# EasyEDA Pro project CSR8675 Minimun System.eprj

# Schematic Schematic1
Create Date: 2023-11-17; Page Name: P1; Project Name: CSR8675 Minimun System; Schematic Name: Schematic1; Update Date: 2024-04-19; Company: 嘉立创EDA; Page Size: A4; Version: V1.0
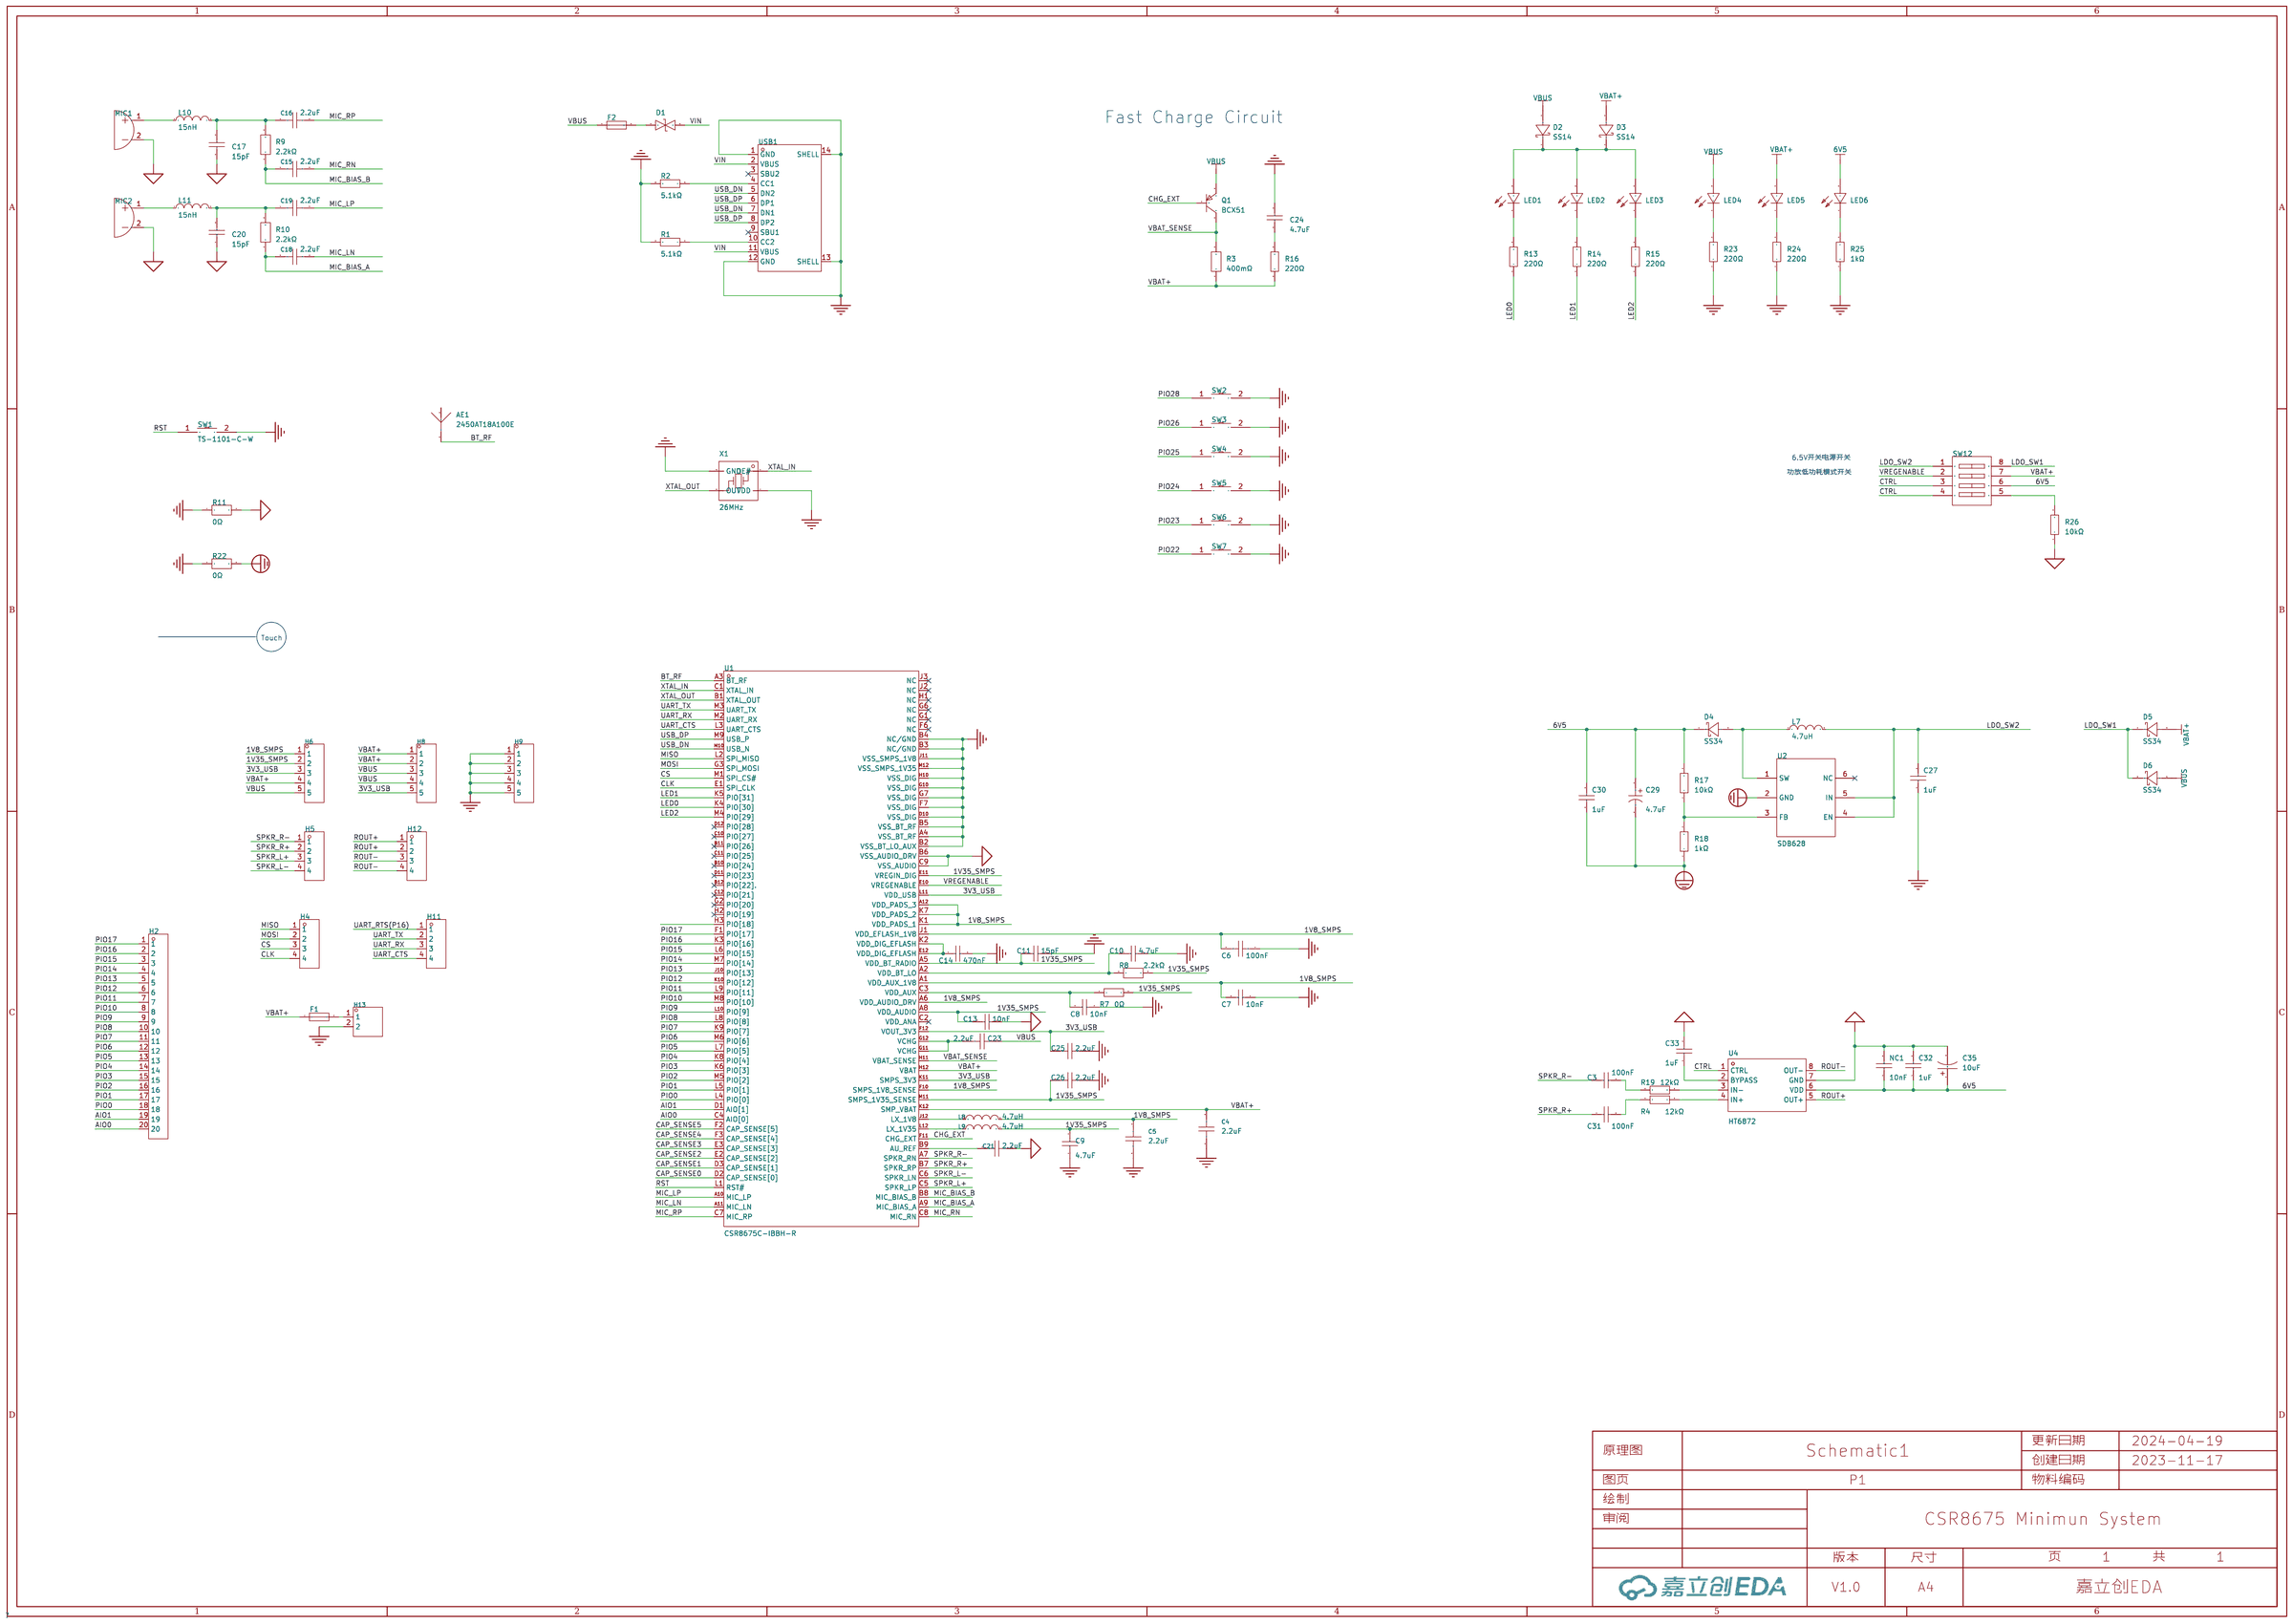
[diagram p0: schematic sheet]

## Parts
AE1  2450AT18A100E  [ANT-SMD_L3.2-W1.6]
C3  100nF  [C0603]
C4  2.2uF  [C0603]
C5  2.2uF  [C0603]
C6  100nF  [C0603]
C7  10nF  [C0603]
C8  10nF  [C0603]
C9  4.7uF  [C0603]
C10  4.7uF  [C0603]
C11  15pF  [C0603]
C13  10nF  [C0603]
C14  470nF  [C0603]
C15  2.2uF  [C0603]
C16  2.2uF  [C0603]
C17  15pF  [C0603]
C18  2.2uF  [C0603]
C19  2.2uF  [C0603]
C20  15pF  [C0603]
C21  2.2uF  [C0603]
C23  2.2uF  [C0603]
C24  4.7uF  [C0805]
C25  2.2uF  [C0603]
C26  2.2uF  [C0603]
C27  1uF  [C0805]
C29  4.7uF  [CAP-TH_BD5.0-P2.00-D0.5-FD]
C30  1uF  [C0805]
C31  100nF  [C0603]
C32  1uF  [C0603]
C33  1uF  [C0603]
C35  10uF  [CAP-TH_BD5.0-P2.00-D0.8-FD]
D1  0603ESDA-05N  [D0603-BI]
D2  SS14  [SOD-123FL_L2.8-W1.8-LS3.7-RD]
D3  SS14  [SOD-123FL_L2.8-W1.8-LS3.7-RD]
D4  SS34  [SMA_L4.3-W2.5-LS5.0-RD]
D5  SS34  [SMA_L4.3-W2.5-LS5.0-RD]
D6  SS34  [SMA_L4.3-W2.5-LS5.0-RD]
F1  BSMD1210L-500  [F1210]
F2  BSMD1210L-500  [F1210]
H2  -  [HDR-TH_20P-P2.54-V-M-1]
H4  -  [HDR-TH_4P-P2.54-V-M]
H5  -  [HDR-TH_4P-P2.54-V-M]
H6  -  [HDR-TH_5P-P2.54-V-M]
H8  -  [HDR-TH_5P-P2.54-V-M]
H9  -  [HDR-TH_5P-P2.54-V-M]
H11  -  [HDR-TH_4P-P2.54-V-M]
H12  -  [HDR-TH_4P-P2.54-V-M]
H13  -  [HDR-TH_2P-P2.54-V-M-1]
L7  4.7uH  [IND-SMD_L4.4-W4.2]
L8  4.7uH  [L0805]
L9  4.7uH  [L0805]
L10  15nH  [L0805]
L11  15nH  [L0805]
LED1  NCD0603R1  [LED0603-RD_RED]
LED2  NCD0603R1  [LED0603-RD_RED]
LED3  NCD0603R1  [LED0603-RD_RED]
LED4  NCD0603R1  [LED0603-RD_RED]
LED5  NCD0603R1  [LED0603-RD_RED]
LED6  NCD0603R1  [LED0603-RD_RED]
MIC1  GMI6027P-34DB  [MIC-TH_BD6.0-P1.90-D0.4-L]
MIC2  GMI6027P-34DB  [MIC-TH_BD6.0-P1.90-D0.4-L]
NC1  10nF  [C0603]
Q1  BCX51  [SOT-89-3_L4.5-W2.5-P1.50-LS4.2-BR]
R1  5.1kΩ  [R0603]
R2  5.1kΩ  [R0603]
R3  400mΩ  [R0805]
R4  12kΩ  [R0603]
R7  0Ω  [R0603]
R8  2.2kΩ  [R0603]
R9  2.2kΩ  [R0603]
R10  2.2kΩ  [R0603]
R11  0Ω  [R0805]
R13  220Ω  [R0603]
R14  220Ω  [R0603]
R15  220Ω  [R0603]
R16  220Ω  [R0805]
R17  10kΩ  [C0805]
R18  1kΩ  [C0805]
R19  12kΩ  [R0603]
R22  0Ω  [R0805]
R23  220Ω  [R0603]
R24  220Ω  [R0603]
R25  1kΩ  [R0603]
R26  10kΩ  [R0603]
SW1  TS-1101-C-W  [SW-SMD_L6.0-W3.3-LS8.0]
SW2  TS-1101-C-W  [SW-SMD_L6.0-W3.3-LS8.0]
SW3  TS-1101-C-W  [SW-SMD_L6.0-W3.3-LS8.0]
SW4  TS-1101-C-W  [SW-SMD_L6.0-W3.3-LS8.0]
SW5  TS-1101-C-W  [SW-SMD_L6.0-W3.3-LS8.0]
SW6  TS-1101-C-W  [SW-SMD_L6.0-W3.3-LS8.0]
SW7  TS-1101-C-W  [SW-SMD_L6.0-W3.3-LS8.0]
SW12  SMXS-04K-TP  [SW-SMD_SMXS-04K-TP]
U1  CSR8675C-IBBH-R  [BGA-112_L6.5-W6.5-P0.50-TL]
U2  SDB628  [SOT-23-6_L2.9-W1.6-P0.95-LS2.8-BR]
U4  HT6872  [SOP-8_L4.9-W3.9-P1.27-LS6.0-BL]
USB1  TYPE-C 16PIN 2MD(073)  [USB-C-SMD_TYPE-C-6PIN-2MD-073]
X1  26MHz  [OSC-SMD_4P-L2.0-W1.6-BL_X201624MKB4SI]

## Library data of the parts
AE1 = 2450AT18A100E: 天线类型:2.4G天线;中心频点:2.4GHz;带宽:-;峰值增益:0.5dBi;极化方式:-;功率容量:2W;驻波比:-;; LCSC Part Name: 2.4G天线; Supplier Part: C89334; Manufacturer: JOHANSON(约翰逊); Supplier Footprint: 1206; JLCPCB Part Class: 扩展库; Datasheet: https://atta.szlcsc.com/upload/public/pdf/source/20180301/C89334_15198946260391384223.pdf; Supplier: LCSC; Antenna Type: 2.4G天线; Central Frequency: 2.4GHz; Peak Gain: 0.5dBi; Impedance: 50Ω; Power capacity: 2W; Operating Temperature: -40℃~+125℃
C3 C31 = 0603B104K500NT: 容值:100nF;精度:±10%;额定电压:50V;材质(温度系数):X7R;; LCSC Part Name: 100nF ±10% 50V; Supplier Part: C30926; Manufacturer: FH(风华); Supplier Footprint: 0603; JLCPCB Part Class: 扩展库; Datasheet: https://atta.szlcsc.com/upload/public/pdf/source/20200305/C486355_26A10D38EF8C2A5C37091D0039909270.pdf; Supplier: LCSC; Tolerance: ±10%; Voltage Rated: 50V; Temperature Coefficient: X7R
C4 C5 C15 C16 C18 C19 C21 = CL10A225KB8NNNC: 容值:2.2uF;精度:±10%;额定电压:50V;材质(温度系数):X5R;; LCSC Part Name: 2.2uF ±10% 50V; Supplier Part: C913904; Manufacturer: SAMSUNG(三星); Supplier Footprint: 0603; JLCPCB Part Class: 扩展库; Datasheet: https://atta.szlcsc.com/upload/public/pdf/source/20160218/1457707763339.pdf; Supplier: LCSC; Tolerance: ±10%; Voltage Rated: 50V; Temperature Coefficient: X5R
C6 = CC0603KRX7R9BB104: 容值:100nF;精度:±10%;额定电压:50V;材质(温度系数):X7R;; LCSC Part Name: 100nF ±10% 50V; Supplier Part: C14663; Manufacturer: YAGEO(国巨); Supplier Footprint: 0603; JLCPCB Part Class: 基础库; Datasheet: https://atta.szlcsc.com/upload/public/pdf/source/20180910/C282072_33301C7F631E79921B82A8DAC6BCC5B3.pdf; Supplier: LCSC; Tolerance: ±10%; Voltage Rated: 50V; Temperature Coefficient: X7R
C7 C8 C13 NC1 = CC0603KRX7R9BB103: 容值:10nF;精度:±10%;额定电压:50V;材质(温度系数):X7R;; LCSC Part Name: 10nF ±10% 50V; Supplier Part: C100042; Manufacturer: YAGEO(国巨); Supplier Footprint: 0603; JLCPCB Part Class: 扩展库; Datasheet: https://atta.szlcsc.com/upload/public/pdf/source/20181008/C309510_22F155564471FAF6A489F7D68F34234E.pdf; Supplier: LCSC; Tolerance: ±10%; Voltage Rated: 50V; Temperature Coefficient: X7R
C9 C24 = CL21A475KAQNNNE: 容值:4.7uF;精度:±10%;额定电压:25V;材质(温度系数):X5R;; LCSC Part Name: 4.7uF ±10% 25V; Supplier Part: C1779; Manufacturer: SAMSUNG(三星); Supplier Footprint: 0805; JLCPCB Part Class: 基础库; Datasheet: https://atta.szlcsc.com/upload/public/pdf/source/20160218/1457707763339.pdf; Supplier: LCSC; Tolerance: ±10%; Voltage Rated: 25V; Temperature Coefficient: X5R
C10 = CL10A475KO8NNNC: 容值:4.7uF;精度:±10%;额定电压:16V;材质(温度系数):X5R;; LCSC Part Name: 4.7uF ±10% 16V; Supplier Part: C19666; Manufacturer: SAMSUNG(三星); Supplier Footprint: 0603; JLCPCB Part Class: 基础库; Datasheet: https://atta.szlcsc.com/upload/public/pdf/source/20160218/1457707763339.pdf; Supplier: LCSC; Tolerance: ±10%; Voltage Rated: 16V; Temperature Coefficient: X5R
C11 C17 C20 = CC0603JRNPO9BN150: 容值:15pF;精度:±5%;额定电压:50V;材质(温度系数):NP0;; LCSC Part Name: 15pF ±5% 50V; Supplier Part: C107037; Manufacturer: YAGEO(国巨); Supplier Footprint: 0603; JLCPCB Part Class: 扩展库; Datasheet: https://atta.szlcsc.com/upload/public/pdf/source/20170914/C128857_1505359892143968080.pdf; Supplier: LCSC; Tolerance: ±5%; Voltage Rated: 50V; Temperature Coefficient: NP0
C14 = CL10B474KA8NNNC: 容值:470nF;精度:±10%;额定电压:25V;材质(温度系数):X7R;; LCSC Part Name: 470nF ±10% 25V; Supplier Part: C1623; Manufacturer: SAMSUNG(三星); Supplier Footprint: 0603; JLCPCB Part Class: 基础库; Datasheet: https://atta.szlcsc.com/upload/public/pdf/source/20160218/1457707763339.pdf; Supplier: LCSC; Tolerance: ±10%; Voltage Rated: 25V; Temperature Coefficient: X7R
C23 C25 C26 = GRM21BD72A225KE01L: 容值:2.2uF;精度:±10%;额定电压:100V;材质(温度系数):X7T;; LCSC Part Name: 2.2uF ±10% 100V; Supplier Part: C2981733; Manufacturer: muRata(村田); Supplier Footprint: 0805; JLCPCB Part Class: 扩展库; Datasheet: https://atta.szlcsc.com/upload/public/pdf/source/20220321/E617CBC6A636009B84263A7C0F0B7534.pdf; Supplier: LCSC; Tolerance: ±10%; Voltage Rated: 100V; Temperature Coefficient: X7T
C27 C30 C32 C33 = CL10A105KB8NNNC: 容值:1uF;精度:±10%;额定电压:50V;材质(温度系数):X5R;; LCSC Part Name: 1uF ±10% 50V; Supplier Part: C15849; Manufacturer: SAMSUNG(三星); Supplier Footprint: 0603; JLCPCB Part Class: 基础库; Datasheet: https://atta.szlcsc.com/upload/public/pdf/source/20160218/1457707763339.pdf; Supplier: LCSC; Tolerance: ±10%; Voltage Rated: 50V; Temperature Coefficient: X5R
C29 = KM1H4R7M0407: 容值:4.7uF;精度:±20%;额定电压:50V;纹波电流:-;等效串联电阻:-;; LCSC Part Name: 4.7uF ±20% 50V; Supplier Part: C2873980; Manufacturer: ROQANG(容强); Supplier Footprint: 插件,D4xL7mm; JLCPCB Part Class: 扩展库; Datasheet: https://atta.szlcsc.com/upload/public/pdf/source/20240320/A280D10F34D0AFC5F78DD559A798EACC.pdf; Supplier: LCSC; Tolerance: ±20%; Rated Voltage: 50V; Lead Spacing: 1.5mm; φD: 4mm; L: 7mm
C35 = 01EC1809SHC10UF50V: 容值:10uF;精度:±20%;额定电压:50V;纹波电流:50mA@120Hz;等效串联电阻:-;; LCSC Part Name: 10uF ±20% 50V; Supplier Part: C503219; Manufacturer: KNSCHA(科尼盛); Supplier Footprint: 插件,D5xL11mm; JLCPCB Part Class: 扩展库; Datasheet: https://atta.szlcsc.com/upload/public/pdf/source/20200324/C503219_39D1683F20D4DB1C41D8BE9142629697.pdf; Supplier: LCSC; Tolerance: ±20%; Rated Voltage: 50V; Ripple Current: 50mA@120Hz; Lead Spacing: 2mm; φD: 5mm; L: 11mm; Lifetime @ Temp: 5000hrs@105℃
D1 = 0603ESDA-05N: 极性:双向;反向截止电压(Vrwm):5V;最大钳位电压:50V;; LCSC Part Name: 双向ESD; Supplier Part: C316054; Manufacturer: BORN(伯恩半导体); Supplier Footprint: 0603; JLCPCB Part Class: 扩展库; Datasheet: https://atta.szlcsc.com/upload/public/pdf/source/20200528/C316054_1CC523E9CE69E41C8DD5A05C832CCD1A.pdf; Supplier: LCSC; polarity: 双向; Reverse Stand-Off Voltage (Vrwm): 5V; Maximum Clamping Voltage: 50V; Type: ESD
D2 D3 = SS14_C2909920: 二极管配置:-;正向压降(Vf):550mV@1A;直流反向耐压(Vr):40V;平均整流电流(Io):1A;; LCSC Part Name: 电压:40V 电流:1A; Supplier Part: C2909920; Manufacturer: KUU; Supplier Footprint: SOD-123FL; JLCPCB Part Class: 扩展库; Datasheet: https://atta.szlcsc.com/upload/public/pdf/source/20211028/6407406DF6AAB99A3E103CB6CA1E22D5.pdf; Supplier: LCSC; Forward Voltage (Vf@If): 550mV@1A; Reverse Voltage (Vr): 40V; Average Rectified Current (Io): 1A; Reverse Leakage Current (Ir): 500uA@40V
D4-D6 = SS34_C727060: 二极管配置:独立式;正向压降(Vf):550mV@3A;直流反向耐压(Vr):40V;平均整流电流(Io):3A;; LCSC Part Name: 电压:40V 电流:3A; Supplier Part: C727060; Manufacturer: TWGMC(台湾迪嘉); Supplier Footprint: SMA(DO-214AC); JLCPCB Part Class: 扩展库; Datasheet: https://atta.szlcsc.com/upload/public/pdf/source/20200828/C727059_6599B6CAC5F3238B9C33E46794659DBE.pdf; Supplier: LCSC; Diode Configuration: 独立式; Forward Voltage (Vf@If): 550mV@3A; Reverse Voltage (Vr): 40V; Average Rectified Current (Io): 3A; Reverse Leakage Current (Ir): 500uA@40V
F1 F2 = BSMD1210L-500: 最大电压:6V;最大电流:50A;保持电流:5A;跳闸电流:10A;; LCSC Part Name: 6V 5A 1210自恢复; Supplier Part: C976308; Manufacturer: BHFUSE(佰宏); Supplier Footprint: 1210; JLCPCB Part Class: 扩展库; Datasheet: https://atta.szlcsc.com/upload/public/pdf/source/20230512/9080FFF75F270CBB88A3FCF75D568934.pdf; Supplier: LCSC; Operating Voltage (Max): 6V; Current Rating (Max): 50A; Hold Current: 5A; Trip Current: 10A; Power Dissipation: 1.5W; Resistance - Initial (Ri) (Min): 1mΩ; Resistance - Post Trip (R1) (Max): 12mΩ; Maximum Time to Trip: 5s; Operating Temperature: -40℃~+85℃
H2 = HDR-M_2.54_1x20P: 间距:2.54mm;总PIN位数:20;排数:1;插针结构:-;行距:-;安装类型:直插;圆针/方针:-;额定电流:-;额定电压:-;配合针长度:-;塑高:-;触头材质:黄铜;触头镀层:-;颜色:黑色;; Supplier Part: C50981; Supplier Footprint: 插件
H4 H5 H11 H12 = HDR-M_2.54_1x4P: Supplier Part: C492403; Supplier Footprint: 插件
H6 H8 H9 = HDR-M_2.54_1x5P: Supplier Part: C358687; Supplier Footprint: 插件
H13 = HDR-M_2.54_1x2P: Supplier Part: C124375; Supplier Footprint: 插件
L7 = FXL0420-4R7-M: 电感值:4.7uH;精度:±20%;额定电流:2.8A;饱和电流(Isat):3A;类型:一体成型电感;; LCSC Part Name: 4.7uH ±20% 3A; Supplier Part: C167208; Manufacturer: cjiang(长江微电); Supplier Footprint: SMD,4.2x4.4mm; JLCPCB Part Class: 扩展库; Datasheet: https://atta.szlcsc.com/upload/public/pdf/source/20230516/FBADA9890E7FBE97C620F1D8B562D733.pdf; Supplier: LCSC; Tolerance: ±20%; Rated Current: 2.8A; Saturation Current (Isat): 3A; DC Resistance (DCR): 105mΩ; Type: 一体成型电感
L8 L9 = LQM21PN4R7MGRD: 电感值:4.7uH;精度:±20%;额定电流:800mA;饱和电流(Isat):-;直流电阻(DCR):288mΩ;; LCSC Part Name: 4.7uH ±20%; Supplier Part: C86090; Manufacturer: muRata(村田); Supplier Footprint: 0805; JLCPCB Part Class: 扩展库; Datasheet: https://atta.szlcsc.com/upload/public/pdf/source/20180326/C86090_F1DCF4677DBA65EF9113FC7328EBFD0F.pdf; Supplier: LCSC; Tolerance: ±20%; Rated Current: 800mA; DC Resistance (DCR): 288mΩ; Frequency - Self Resonant: 30MHz
L10 L11 = VHF201209H15NJT: 电感值:15nH;精度:±5%;额定电流:300mA;饱和电流(Isat):-;直流电阻(DCR):400mΩ;; LCSC Part Name: 15nH ±5%; Supplier Part: C139275; Manufacturer: FH(风华); Supplier Footprint: 0805; JLCPCB Part Class: 扩展库; Datasheet: https://atta.szlcsc.com/upload/public/pdf/source/20230223/DB206AC541C71FBD79E291598E86C2F5.pdf; Supplier: LCSC; Tolerance: ±5%; Rated Current: 300mA; DC Resistance (DCR): 400mΩ
LED1-LED6 = NCD0603R1_C84263: 灯头类型:-;发光颜色:红色;正向电压(VF):1.6V~2.6V;功率:65mW;正向电流:20mA;主波长:615nm~630nm;二极管配置:独立二极管;透镜颜色:无色透明透镜;色温:-;发光强度:80mcd~220mcd;发光角度:130°;载带方式:-;工作温度:-30℃~+85℃;; Supplier Part: C84263; Manufacturer: 国星光电; Supplier Footprint: 0603; JLCPCB Part Class: 扩展库; Datasheet: https://atta.szlcsc.com/upload/public/pdf/source/20200820/C84263_DABC6A75E58F576973B407FDBA283D60.pdf; Supplier: LCSC; Emitted Color: 红色; Forward Voltage (VF): 1.6V~2.6V; Power Dissipation: 65mW; Forward Current: 20mA; Dominant Wavelength: 615nm~630nm; Diode Configuration: 独立二极管; Lens Color: 无色透明透镜; Luminous Intensity: 80mcd~220mcd; Viewing Angle: 130°; Operating Temperature: -30℃~+85℃
MIC1 MIC2 = GMI6027P-34DB: Supplier Part: C529954; Manufacturer: INGHAi(赢海); JLCPCB Part Class: 扩展库; Datasheet: https://atta.szlcsc.com/upload/public/pdf/source/20200702/C529952_807F7012EAC801A742D0A79789145B73.pdf; Supplier: LCSC
Q1 = BCX51: 晶体管类型:PNP;集电极电流(Ic):1A;集射极击穿电压(Vceo):45V;功率(Pd):1W;直流电流增益(hFE@Ic,Vce):25@5mA,2V;; LCSC Part Name: 耐压:45V 电流:1A PNP; Supplier Part: C475862; Manufacturer: SHIKUES(时科); Supplier Footprint: SOT-89-3; JLCPCB Part Class: 扩展库; Datasheet: https://atta.szlcsc.com/upload/public/pdf/source/20200113/C475862_381956299D1CDF6A826AA18DA7A0C20E.pdf; Supplier: LCSC; Transistor Type: PNP; Collector Current (Ic): 1A; Collector-Emitter Breakdown Voltage (Vceo): 45V; Power Dissipation (Pd): 1W; DC Current Gain (hFE@Ic,Vce): 25@5mA,2V; Collector Cut-Off Current (Icbo): 20uA; Collector-Emitter Saturation Voltage (VCE(sat)@Ic,Ib): 500mV@500mA,50mA
R1 R2 = 0603WAF5101T5E: 电阻类型:厚膜电阻;阻值:5.1kΩ;精度:±1%;功率:100mW;最大工作电压:75V;温度系数:±100ppm/℃;; LCSC Part Name: 5.1kΩ ±1% 100mW 厚膜电阻; Supplier Part: C23186; Manufacturer: UNI-ROYAL(厚声); Supplier Footprint: 0603; JLCPCB Part Class: 基础库; Datasheet: https://atta.szlcsc.com/upload/public/pdf/source/20200306/C422600_1E6D84923E4A46A82E41ADD87F860B5C.pdf; Supplier: LCSC; Type: 厚膜电阻; Tolerance: ±1%; Power(Watts): 100mW; Overload Voltage (Max): 75V; Temperature Coefficient: ±100ppm/℃; Operating Temperature Range: -55℃~+155℃
R3 = FRL0805FR400TS: 电阻类型:厚膜电阻;阻值:400mΩ;精度:±1%;功率:125mW;最大工作电压:300V;温度系数:±300ppm/℃;; LCSC Part Name: 400mΩ ±1% 125mW 厚膜电阻; Supplier Part: C2934266; Manufacturer: FOJAN(富捷); Supplier Footprint: 0805; JLCPCB Part Class: 扩展库; Datasheet: https://atta.szlcsc.com/upload/public/pdf/source/20211221/925EC7D7225764EE0046F22065062C87.pdf; Supplier: LCSC; Type: 厚膜电阻; Tolerance: ±1%; Power(Watts): 125mW; Overload Voltage (Max): 300V; Temperature Coefficient: ±300ppm/℃; Operating Temperature Range: -55℃~+155℃
R4 R19 = 0603WAF1202T5E: 电阻类型:厚膜电阻;阻值:12kΩ;精度:±1%;功率:100mW;最大工作电压:75V;温度系数:±100ppm/℃;; LCSC Part Name: 12kΩ ±1% 100mW 厚膜电阻; Supplier Part: C22790; Manufacturer: UNI-ROYAL(厚声); Supplier Footprint: 0603; JLCPCB Part Class: 基础库; Datasheet: https://atta.szlcsc.com/upload/public/pdf/source/20200306/C422600_1E6D84923E4A46A82E41ADD87F860B5C.pdf; Supplier: LCSC; Type: 厚膜电阻; Tolerance: ±1%; Power(Watts): 100mW; Overload Voltage (Max): 75V; Temperature Coefficient: ±100ppm/℃; Operating Temperature Range: -55℃~+155℃
R7 = 0603WAF0000T5E: 电阻类型:厚膜电阻;阻值:0Ω;精度:±1%;功率:100mW;最大工作电压:75V;; LCSC Part Name: 0Ω ±1% 100mW 厚膜电阻; Supplier Part: C21189; Manufacturer: UNI-ROYAL(厚声); Supplier Footprint: 0603; JLCPCB Part Class: 基础库; Datasheet: https://atta.szlcsc.com/upload/public/pdf/source/20200306/C422600_1E6D84923E4A46A82E41ADD87F860B5C.pdf; Supplier: LCSC; Type: 厚膜电阻; Tolerance: ±1%; Power(Watts): 100mW; Overload Voltage (Max): 75V; Operating Temperature Range: -55℃~+155℃
R8-R10 = FRC0603J222 TS: 电阻类型:厚膜电阻;阻值:2.2kΩ;精度:±5%;功率:100mW;最大工作电压:75V;温度系数:±100ppm/℃;; LCSC Part Name: 2.2kΩ ±5% 100mW 厚膜电阻; Supplier Part: C2907117; Manufacturer: FOJAN(富捷); Supplier Footprint: 0603; JLCPCB Part Class: 扩展库; Datasheet: https://atta.szlcsc.com/upload/public/pdf/source/20211221/925EC7D7225764EE0046F22065062C87.pdf; Supplier: LCSC; Type: 厚膜电阻; Tolerance: ±5%; Power(Watts): 100mW; Overload Voltage (Max): 75V; Temperature Coefficient: ±100ppm/℃; Operating Temperature Range: -55℃~+155℃
R11 R22 = FRC0805P000 TS: 电阻类型:厚膜电阻;阻值:0Ω;精度:±5%;功率:125mW;最大工作电压:150V;; LCSC Part Name: 0Ω ±5% 125mW 厚膜电阻; Supplier Part: C2907288; Manufacturer: FOJAN(富捷); Supplier Footprint: 0805; JLCPCB Part Class: 扩展库; Datasheet: https://atta.szlcsc.com/upload/public/pdf/source/20211221/925EC7D7225764EE0046F22065062C87.pdf; Supplier: LCSC; Type: 厚膜电阻; Tolerance: ±5%; Power(Watts): 125mW; Overload Voltage (Max): 150V; Operating Temperature Range: -55℃~+155℃
R13-R15 R23 R24 = 0603WAJ0221T5E: 电阻类型:厚膜电阻;阻值:220Ω;精度:±5%;功率:100mW;最大工作电压:75V;温度系数:±100ppm/℃;; LCSC Part Name: 220Ω ±5% 100mW 厚膜电阻; Supplier Part: C1226; Manufacturer: UNI-ROYAL(厚声); Supplier Footprint: 0603; JLCPCB Part Class: 扩展库; Datasheet: https://atta.szlcsc.com/upload/public/pdf/source/20200306/C422600_1E6D84923E4A46A82E41ADD87F860B5C.pdf; Supplier: LCSC; Type: 厚膜电阻; Tolerance: ±5%; Power(Watts): 100mW; Overload Voltage (Max): 75V; Temperature Coefficient: ±100ppm/℃; Operating Temperature Range: -55℃~+155℃
R16 = 0805W8F2200T5E: 电阻类型:厚膜电阻;阻值:220Ω;精度:±1%;功率:125mW;最大工作电压:150V;温度系数:±100ppm/℃;; LCSC Part Name: 220Ω ±1% 125mW 厚膜电阻; Supplier Part: C17557; Manufacturer: UNI-ROYAL(厚声); Supplier Footprint: 0805; JLCPCB Part Class: 基础库; Datasheet: https://atta.szlcsc.com/upload/public/pdf/source/20200306/C422600_1E6D84923E4A46A82E41ADD87F860B5C.pdf; Supplier: LCSC; Type: 厚膜电阻; Tolerance: ±1%; Power(Watts): 125mW; Overload Voltage (Max): 150V; Temperature Coefficient: ±100ppm/℃; Operating Temperature Range: -55℃~+155℃
R17 R26 = 0603WAF1002T5E: 电阻类型:厚膜电阻;阻值:10kΩ;精度:±1%;功率:100mW;最大工作电压:75V;温度系数:±100ppm/℃;; LCSC Part Name: 厚膜电阻 10kΩ ±1% 100mW; Supplier Part: C25804; Manufacturer: UNI-ROYAL(厚声); Supplier Footprint: 0603; JLCPCB Part Class: 基础库; Datasheet: https://atta.szlcsc.com/upload/public/pdf/source/20200306/C422600_1E6D84923E4A46A82E41ADD87F860B5C.pdf; Supplier: LCSC; Type: 厚膜电阻; Tolerance: ±1%; Power(Watts): 100mW; Overload Voltage (Max): 75V; Temperature Coefficient: ±100ppm/℃; Operating Temperature Range: -55℃~+155℃
R18 R25 = RC0603FR-071KL: 电阻类型:厚膜电阻;阻值:1kΩ;精度:±1%;功率:100mW;最大工作电压:75V;温度系数:±100ppm/℃;; LCSC Part Name: 厚膜电阻 1kΩ ±1% 100mW; Supplier Part: C22548; Manufacturer: YAGEO(国巨); Supplier Footprint: 0603; JLCPCB Part Class: 扩展库; Datasheet: https://atta.szlcsc.com/upload/public/pdf/source/20180316/70C0E2BDAE7FCC62C531A5A58D202EE1.pdf; Supplier: LCSC; Type: 厚膜电阻; Tolerance: ±1%; Power(Watts): 100mW; Overload Voltage (Max): 75V; Temperature Coefficient: ±100ppm/℃; Operating Temperature Range: -55℃~+155℃
SW1-SW7 = TS-1101-C-W: 电路结构:单刀单掷;按钮形状:矩形按钮;作用力:260gf;安装方式:立贴;开关长度:6mm;开关宽度:3.6mm;开关高度:2.5mm;带支架:不带;触点电流:50mA;额定电压(AC):-;额定电压(DC):12V;额定功率:-;绝缘电阻:-;带灯:无;机械寿命:5万次;; LCSC Part Name: 6*3.6*2.5mm 立贴 轻触开关; Supplier Part: C318938; Manufacturer: XKB Connectivity(中国星坤); Supplier Footprint: SMD; JLCPCB Part Class: 扩展库; Datasheet: https://atta.szlcsc.com/upload/public/pdf/source/20200227/C318938_C2E53B1EEDE37D980A33616AC086DE53.pdf; Supplier: LCSC; Circuit: 单刀单掷; Actuator Style: 矩形按钮; Operating Force: 260gf; Mounting Style: 立贴; Switch Length: 6mm; Switch Width: 3.6mm; Switch Height: 2.5mm; Strike Gundam: 不带; Contact Current: 50mA; Voltage Rating (DC): 12V; Actuator/Cap Color: 白色带淡绿; With Lamp: 无; Mechanical Life: 5万次; Operating Temperature: -30℃~+85℃
SW12 = SMXS-04K-TP: 类型:-;电路结构:-;开关位数:4位;额定电流:-;额定电压:-;使用寿命:3千次;颜色:黑色;; LCSC Part Name: 间距2.54mm 4位拨码开关; Supplier Part: C5439763; Manufacturer: SM Switch; Supplier Footprint: SMD; JLCPCB Part Class: 扩展库; Datasheet: https://atta.szlcsc.com/upload/public/pdf/source/20230330/8AD8133DE12F908DA8232583C3CE8C7F.pdf; Supplier: LCSC; Number of Positions: 4位; Lead Pitch: 2.54mm; Operating Temperature: -30℃~+85℃; Operating Life: 3千次; Color: 黑色
U1 = CSR8675C-IBBH-R: 频率范围:2.4GHz;接口:I2S;应用领域:蓝牙;灵敏度:-90dBm;; Supplier Part: C3606593; Manufacturer: Qualcomm; Supplier Footprint: VFBGA-112; JLCPCB Part Class: 扩展库; Supplier: LCSC; Frequency Range: 2.4GHz; Interface: I2S; Operating Voltage: 3.3V; Applications: 蓝牙; Output Power: 10dBm; Sensitivity: -90dBm
U2 = SDB628: 功能类型:升压型;输入电压:2V~24V;输出电压:28V;输出电流(最大值):2A;; Supplier Part: C77805; Manufacturer: SHOUDING(首鼎半导体); Supplier Footprint: SOT-23-6; JLCPCB Part Class: 扩展库; Datasheet: https://atta.szlcsc.com/upload/public/pdf/source/20160823/1471947522087.pdf; Supplier: LCSC; Function: 升压型; Input Voltage: 2V~24V; Output Voltage: 28V; Output Current (Max): 2A; Switching Frequency: 1.2MHz; Synchronous Rectification: 否; Number of Outputs: 1; Topology: 升压式; Switch tube (built-in/external): 内置
U4 = HT6872: 功放类型:D类功放;扬声器通道数:单声道;输出功率:3.85Wx1@4Ω;; LCSC Part Name: 3.85W单声道D类音频功率放大器; Supplier Part: C93112; Manufacturer: 嘉兴禾润; Supplier Footprint: SOP-8; JLCPCB Part Class: 扩展库; Datasheet: https://atta.szlcsc.com/upload/public/pdf/source/20170925/C93112_1506321759294990568.pdf; Supplier: LCSC; Type of Power Amplifier: D类功放; Speaker Channels: 单声道; Output Power: 3.85Wx1@4Ω; Supply Voltage: 2.5V~6.5V
USB1 = TYPE-C 16PIN 2MD(073): 连接器类型:Type-C;标准:-;公母:母;端口数量:1;触点数量:16P;安装方式:卧贴;额定电流 - 电源:5A;工作温度范围:-25℃~+85℃;; LCSC Part Name: Type-C 母 卧贴; Supplier Part: C2765186; Manufacturer: SHOU HAN(首韩); Supplier Footprint: SMD; JLCPCB Part Class: 扩展库; Datasheet: https://atta.szlcsc.com/upload/public/pdf/source/20211123/39B17C16241EAC15C5E277BDA434118E.pdf; Supplier: LCSC; Connector Type: Type-C; Gender: 母; Number of Ports: 1; Number of Contacts: 16P; Mounting Style: 卧贴; Current Rating - Power (Max): 5A; Operating Temperature Range: -25℃~+85℃
X1 = OT201626MJBA4SL: 频率:26MHz;工作电压:1.8V~3.3V;供电电流:4mA;频率稳定度(全温):±10ppm;; LCSC Part Name: 26MHz ±10ppm 1.8V~3.3V YSO110TR; Supplier Part: C669081; Manufacturer: YXC(扬兴晶振); Supplier Footprint: SMD2016-4P; JLCPCB Part Class: 扩展库; Datasheet: https://atta.szlcsc.com/upload/public/pdf/source/20210329/C669065_30B18CFE780D377BA4E84F6ED1951959.pdf; Supplier: LCSC; Supply Voltage: 1.8V~3.3V; Supply Current (Max): 4mA; Frequency Stability(Full temperature range): ±10ppm; Operating Temperature: -40℃~+85℃

## Nets
1V8_SMPS: C5.1 C6.2 C7.2 H6.1 L8.2 U1.A1(VDD_AUX_1V8) U1.A6(VDD_AUDIO_DRV) U1.A12(VDD_PADS_3) U1.F10(SMPS_1V8_SENSE) U1.J1(VDD_EFLASH_1V8) U1.K1(VDD_PADS_1) U1.K7(VDD_PADS_2)
1V35_SMPS: C9.2 C11.1 C13.1 C26.1 H6.2 L9.2 R7.2 R8.2 U1.A5(VDD_BT_RADIO) U1.A8(VDD_AUDIO) U1.E11(VREGIN_DIG) U1.M11(SMPS_1V35_SENSE)
3V3_USB: C25.1 H6.3 H8.5 U1.F12(VOUT_3V3) U1.K11(SMPS_3V3) U1.L11(VDD_USB)
6V5: C29.1 C30.2 C32.1 C35.1 D4.1(C) LED6.2(A) NC1.1 R17.2 SW12.6 U4.6(VDD)
AGND: C13.2 C17.1 C20.1 C21.2 C32.2 C33.2 C35.2 MIC1.2 MIC2.2 NC1.2 R11.2 R26.1 U1.B6(VSS_AUDIO_DRV) U1.C9(VSS_AUDIO) U4.7(GND)
GND: C4.1 C5.2 C6.1 C7.1 C8.1 C9.1 C10.2 C11.2 C14.2 C24.2 C25.2 C26.2 C27.1 H9.1 H9.2 H9.3 H9.4 H9.5 H13.2 R1.2 R2.2 R11.1 R22.1 R23.1 R24.1 R25.1 SW1.2 SW2.2 SW3.2 SW4.2 SW5.2 SW6.2 SW7.2 U1.A4(VSS_BT_RF) U1.B2(VSS_BT_LO_AUX) U1.B3(NC/GND) U1.B4(NC/GND) U1.B5(VSS_BT_RF) U1.D10(VSS_DIG) U1.F7(VSS_DIG) U1.G7(VSS_DIG) U1.G10(VSS_DIG) U1.H10(VSS_DIG) U1.J11(VSS_SMPS_1V8) U1.M12(VSS_SMPS_1V35) USB1.1(GND) USB1.12(GND) USB1.13(SHELL) USB1.14(SHELL) X1.2(GND) X1.4(VDD)
PGND: C29.2 C30.1 R18.1 R22.2 U2.2(GND)
VBAT+: C4.2 D3.2(K) D5.2(A) F1.1 H6.4 H8.1 H8.2 LED5.2(A) R3.1 R16.1 SW12.7 U1.H12(VBAT) U1.K12(SMP_VBAT)
VBAT_SENSE: Q1.2(C) R3.2 U1.H11(VBAT_SENSE)
VBUS: C23.2 D2.2(K) D6.2(A) F2.1 H6.5 H8.3 H8.4 LED4.2(A) Q1.3(E)
VIN: D1.2 USB1.2(VBUS) USB1.11(VBUS)
AIO0: H2.20 U1.C4(AIO[0])
AIO1: H2.19 U1.D1(AIO[1])
BT_RF: AE1.1(ANT) U1.A3(BT_RF)
CAP_SENSE0: U1.D2(CAP_SENSE[0])
CAP_SENSE1: U1.D3(CAP_SENSE[1])
CAP_SENSE2: U1.E2(CAP_SENSE[2])
CAP_SENSE3: U1.E3(CAP_SENSE[3])
CAP_SENSE4: U1.F3(CAP_SENSE[4])
CAP_SENSE5: U1.F2(CAP_SENSE[5])
CHG_EXT: Q1.1(B) U1.F11(CHG_EXT)
CLK: H4.4 U1.E1(SPI_CLK)
CS: H4.3 U1.M1(SPI_CS#)
CTRL: SW12.3 SW12.4 U4.1(CTRL)
LDO_SW1: D5.1(C) D6.1(C) SW12.8
LDO_SW2: C27.2 L7.2 SW12.1 U2.4(EN) U2.5(IN)
LED0: R13.1 U1.K4(PIO[30])
LED1: R14.1 U1.K5(PIO[31])
LED2: R15.1 U1.M4(PIO[29])
MIC_BIAS_A: C18.1 R10.1 U1.A9(MIC_BIAS_A)
MIC_BIAS_B: C15.1 R9.1 U1.B8(MIC_BIAS_B)
MIC_LN: C18.2 U1.A11(MIC_LN)
MIC_LP: C19.2 U1.A10(MIC_LP)
MIC_RN: C15.2 U1.C8(MIC_RN)
MIC_RP: C16.2 U1.C7(MIC_RP)
MISO: H4.1 U1.L2(SPI_MISO)
MOSI: H4.2 U1.G3(SPI_MOSI)
PIO0: H2.18 U1.L4(PIO[0])
PIO1: H2.17 U1.L5(PIO[1])
PIO2: H2.16 U1.M5(PIO[2])
PIO3: H2.15 U1.K6(PIO[3])
PIO4: H2.14 U1.K8(PIO[4])
PIO5: H2.13 U1.L7(PIO[5])
PIO6: H2.12 U1.M6(PIO[6])
PIO7: H2.11 U1.K9(PIO[7])
PIO8: H2.10 U1.L8(PIO[8])
PIO9: H2.9 U1.L10(PIO[9])
PIO10: H2.8 U1.M8(PIO[10])
PIO11: H2.7 U1.L9(PIO[11])
PIO12: H2.6 U1.K10(PIO[12])
PIO13: H2.5 U1.J10(PIO[13])
PIO14: H2.4 U1.M7(PIO[14])
PIO15: H2.3 U1.L6(PIO[15])
PIO16: H2.2 U1.K3(PIO[16])
PIO17: H2.1 U1.F1(PIO[17])
PIO22: SW7.1
PIO23: SW6.1
PIO24: SW5.1
PIO25: SW4.1
PIO26: SW3.1
PIO28: SW2.1
ROUT+: H12.1 H12.2 U4.5(OUT+)
ROUT-: H12.3 H12.4 U4.8(OUT-)
RST: SW1.1 U1.L1(RST#)
SPKR_L+: H5.3 U1.C5(SPKR_LP)
SPKR_L-: H5.4 U1.C6(SPKR_LN)
SPKR_R+: C31.1 H5.2 U1.B7(SPKR_RP)
SPKR_R-: C3.1 H5.1 U1.A7(SPKR_RN)
UART_CTS: H11.4 U1.L3(UART_CTS)
UART_RTS(P16): H11.1
UART_RX: H11.3 U1.M2(UART_RX)
UART_TX: H11.2 U1.M3(UART_TX)
USB_DN: U1.M10(USB_N) USB1.5(DN2) USB1.7(DN1)
USB_DP: U1.M9(USB_P) USB1.6(DP1) USB1.8(DP2)
VREGENABLE: SW12.2 U1.E10(VREGENABLE)
XTAL_IN: U1.C1(XTAL_IN) X1.1(OE#)
XTAL_OUT: U1.B1(XTAL_OUT) X1.3(OUT)
$1N4263: R2.1 USB1.4(CC1)
$1N4265: R1.1 USB1.10(CC2)
$1N4429: C23.1 U1.G11(VCHG) U1.G12(VCHG)
$1N4631: L8.1 U1.J12(LX_1V8)
$1N5186: C8.2 R7.1 U1.C3(VDD_AUX)
$1N5323: L9.1 U1.L12(LX_1V35)
$1N5614: C10.1 R8.1 U1.A2(VDD_BT_LO)
$1N6128: C14.1 U1.E12(VDD_DIG_EFLASH) U1.K2(VDD_DIG_EFLASH)
$1N7565: C16.1 C17.2 L10.2 R9.2
$1N7575: L10.1 MIC1.1
$1N7808: C19.1 C20.2 L11.2 R10.2
$1N7817: L11.1 MIC2.1
$1N9013: C21.1 U1.B9(AU_REF)
$1N10961: D1.1 F2.2
$1N11416: C24.1 R16.2
$1N15209: D2.1(A) D3.1(A) LED1.2(A) LED2.2(A) LED3.2(A)
$1N15411: LED1.1(K) R13.2
$1N15417: LED2.1(K) R14.2
$1N15420: LED3.1(K) R15.2
$1N22358: D4.2(A) L7.1 U2.1(SW)
$1N22359: R17.1 R18.2 U2.3(FB)
$1N22776: R19.2 U4.3(IN-)
$1N22777: R4.2 U4.4(IN+)
$1N22778: C3.2 R19.1
$1N22779: C31.2 R4.1
$1N22784: C33.1 U4.2(BYPASS)
$1N33764: LED4.1(K) R23.2
$1N33767: LED5.1(K) R24.2
$1N33908: LED6.1(K) R25.2
$1N33999: F1.2 H13.1
$1N43561: R26.2 SW12.5

Not connected (* = marked no-connect by the designer): AE1 2; U1 B10(PIO[24])* B11(PIO[26])* B12(PIO[22].)* C2(VDD_ANA)* C10(PIO[27])* C11(PIO[25])* C12(PIO[21])* D11(PIO[23])* D12(PIO[28])* F6(NC)* G1(NC)* G2(PIO[20])* G6(NC)* H1(NC)* H2(PIO[19])* H3(PIO[18]) J2(NC)* J3(NC)*; U2 6(NC)*; USB1 3(SBU2)* 9(SBU1)*

## Notes on the sheet
- Fast Charge Circuit
- 6.5V开关电源开关
- 功放低功耗模式开关
- Touch

# Board PCB1
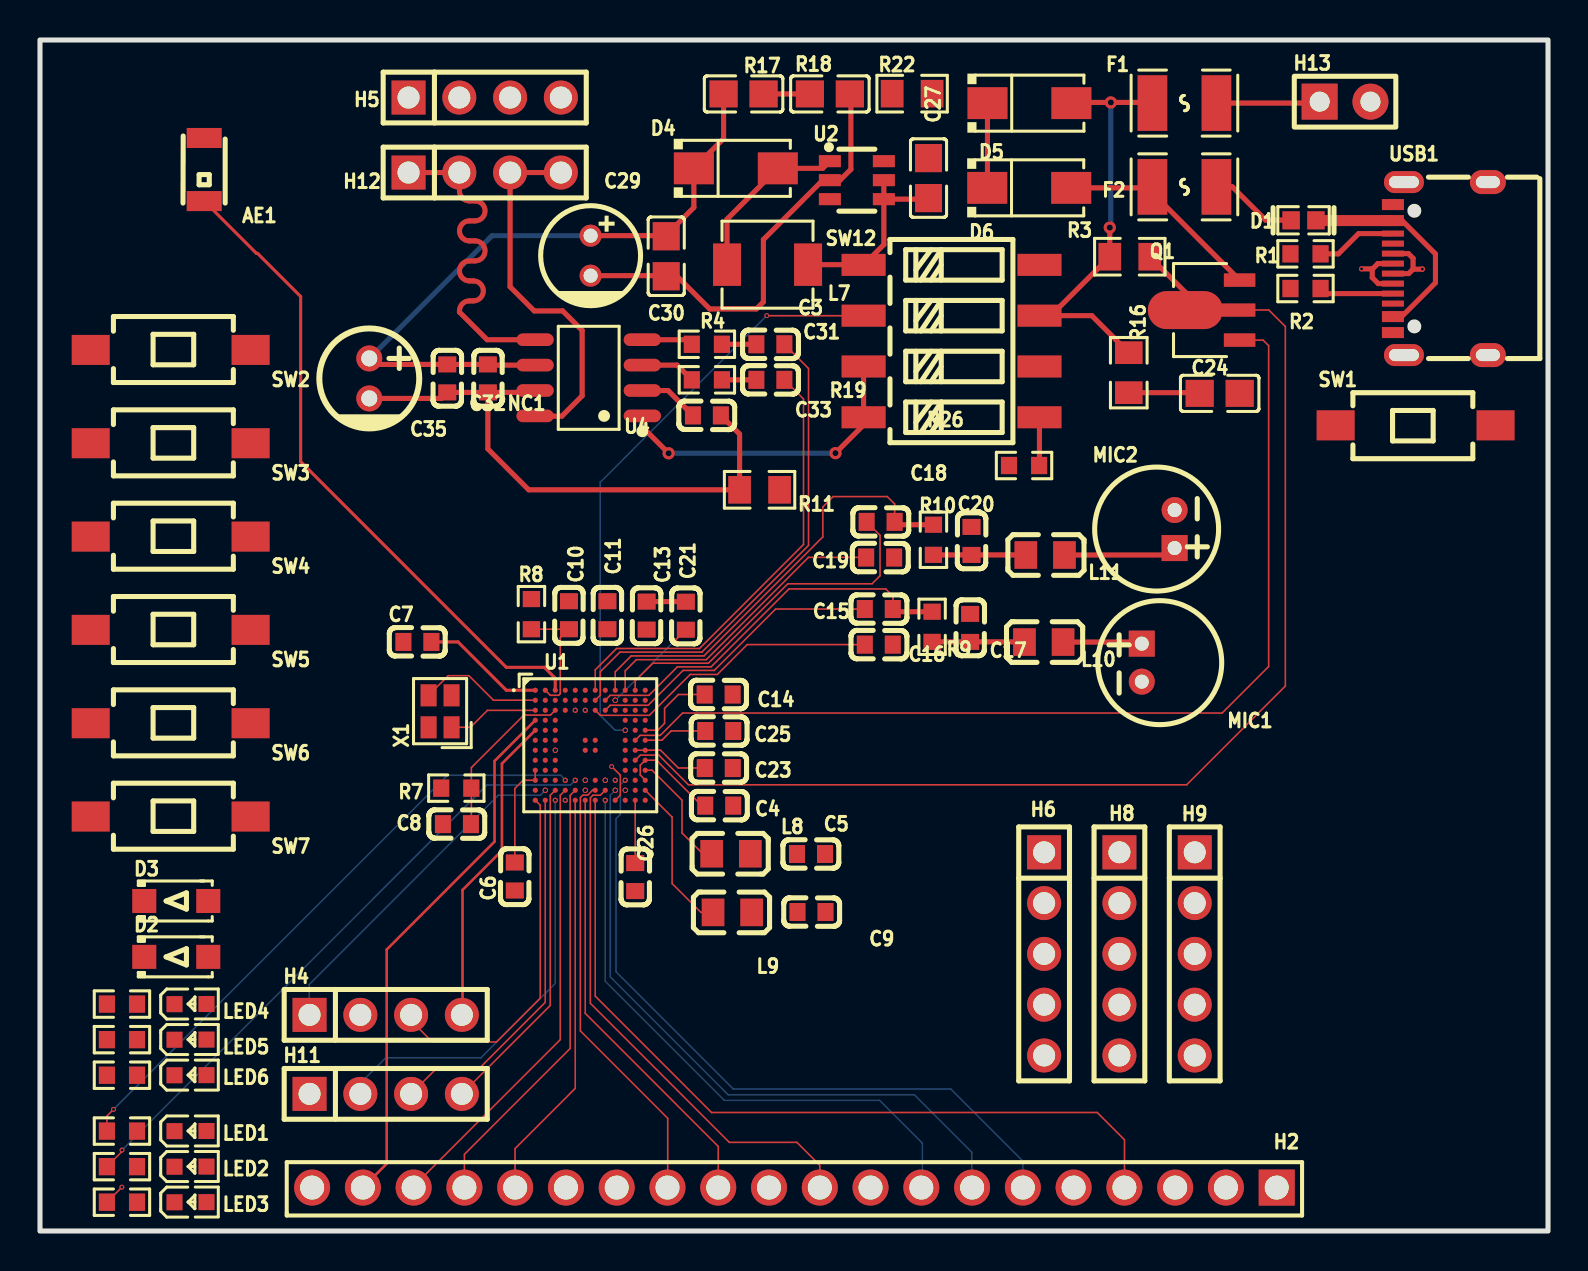
[diagram p1: board, top side]
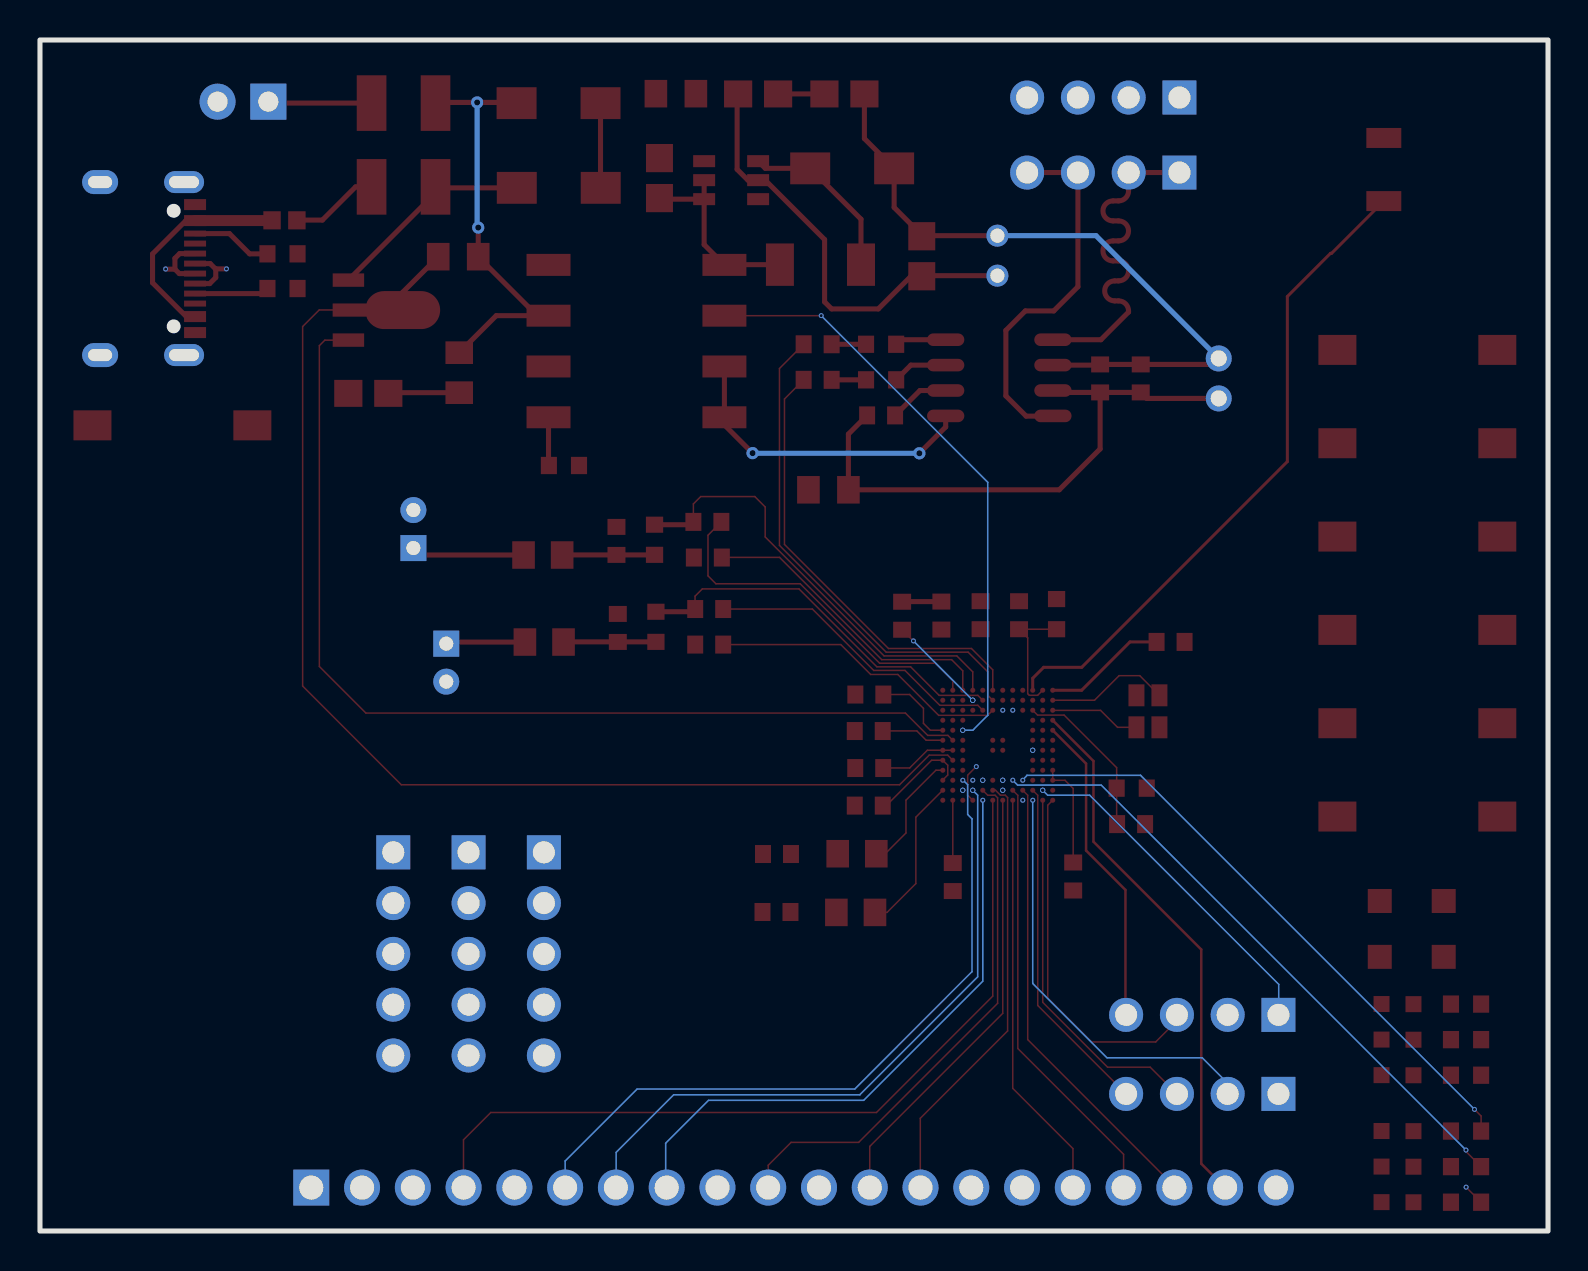
[diagram p2: board, bottom side, seen from below]

Outline 75.45 x 59.56 mm; copper layers: Top Layer, Inner1, Inner2, Inner3, Inner4, Bottom Layer. Coordinates in mm from the lower left corner of the outline.
Outline path: rectangle 0,59.56 75.45,0
Stack: Top Layer 0.035mm 外层铜厚1oz / Dielectric1 0.0994mm 3313 RC57% 4.2mil / Inner1 0.0152mm 内层铜厚 / Dielectric2 0.55mm 0.55mm H/H不含铜 / Inner2 0.0152mm 内层铜厚 / Dielectric3 0.1088mm 2116 RC54% 4.9mil / Inner3 0.0152mm 内层铜厚 / Dielectric4 0.55mm 0.55mm H/H不含铜 / Inner4 0.0152mm 内层铜厚 / Dielectric5 0.0994mm 3313 RC57% 4.2mil / Bottom Layer 0.035mm 外层铜厚1oz

## Design rules (mm)
net SPKR_L+: DP1
net SPKR_L-: DP1
template: 自定义配置
spacing copperThickness1oz (default): track to track 0.08, other pairs 0.051 to 0.3
spacing copperThickness2oz: track to track 0.203, other pairs 0.152 to 0.3
track width copperThickness1oz (default): min 0.025, default 0.254, max 2.54
track width copperThickness2oz: min 0.203, default 0.254, max 2.54
differential pair differentialPair (default): width min 0.127, default 0.254, max 2.54; gap min 0.152, default 0.152
via viaSize (default): diameter min 0.1, default 0.256, max 10; hole min 0.1, default 0.128, max 6.299

## Placement (name value [footprint] x y rotation side)
AE1  2450AT18A100E  [ANT-SMD_L3.2-W1.6]  8.22 53.08 90 top
C3  100nF  [C0603]  36.54 42.56 180 top
C4  2.2uF  [C0603]  33.98 21.27 180 top
C5  2.2uF  [C0603]  38.57 18.85 0 top
C6  100nF  [C0603]  23.76 17.73 90 top
C7  10nF  [C0603]  18.88 29.46 0 top
C8  10nF  [C0603]  20.86 20.35 0 top
C9  4.7uF  [C0603]  38.6 15.95 180 top
C10  4.7uF  [C0603]  26.47 30.79 90 top
C11  15pF  [C0603]  28.39 30.79 90 top
C13  10nF  [C0603]  30.35 30.77 90 top
C14  470nF  [C0603]  33.95 26.82 0 top
C15  2.2uF  [C0603]  41.97 31.1 180 top
C16  2.2uF  [C0603]  41.97 29.32 180 top
C17  15pF  [C0603]  46.54 30.16 270 top
C18  2.2uF  [C0603]  42.06 35.46 180 top
C19  2.2uF  [C0603]  42.03 33.68 180 top
C20  15pF  [C0603]  46.61 34.51 270 top
C21  2.2uF  [C0603]  32.31 30.77 90 top
C23  2.2uF  [C0603]  33.96 23.15 0 top
C24  4.7uF  [C0805]  59.02 41.89 0 top
C25  2.2uF  [C0603]  33.99 25 0 top
C26  2.2uF  [C0603]  29.78 17.7 270 top
C27  1uF  [C0805]  44.45 52.65 270 top
C29  4.7uF  [CAP-TH_BD5.0-P2.00-D0.5-FD]  27.55 48.77 270 top
C30  1uF  [C0805]  31.33 48.74 90 top
C31  100nF  [C0603]  36.54 44.34 180 top
C32  1uF  [C0603]  20.38 42.63 270 top
C33  1uF  [C0603]  33.37 40.78 0 top
C35  10uF  [CAP-TH_BD5.0-P2.00-D0.8-FD]  16.48 42.63 270 top
D1  0603ESDA-05N  [D0603-BI]  63.22 50.54 0 top
D2  SS14  [SOD-123FL_L2.8-W1.8-LS3.7-RD]  6.82 13.71 0 top
D3  SS14  [SOD-123FL_L2.8-W1.8-LS3.7-RD]  6.82 16.5 0 top
D4  SS34  [SMA_L4.3-W2.5-LS5.0-RD]  34.81 53.14 0 top
D5  SS34  [SMA_L4.3-W2.5-LS5.0-RD]  49.5 56.4 0 top
D6  SS34  [SMA_L4.3-W2.5-LS5.0-RD]  49.49 52.16 0 top
F1  BSMD1210L-500  [F1210]  57.26 56.4 0 top
F2  BSMD1210L-500  [F1210]  57.26 52.21 0 top
H2  -  [HDR-TH_20P-P2.54-V-M-1]  37.74 2.17 180 top
H4  -  [HDR-TH_4P-P2.54-V-M]  17.3 10.81 0 top
H5  -  [HDR-TH_4P-P2.54-V-M]  22.25 56.68 0 top
H6  -  [HDR-TH_5P-P2.54-V-M]  50.24 13.86 270 top
H8  -  [HDR-TH_5P-P2.54-V-M]  54.01 13.86 270 top
H9  -  [HDR-TH_5P-P2.54-V-M]  57.77 13.86 270 top
H11  -  [HDR-TH_4P-P2.54-V-M]  17.3 6.86 0 top
H12  -  [HDR-TH_4P-P2.54-V-M]  22.25 52.93 0 top
H13  -  [HDR-TH_2P-P2.54-V-M-1]  65.29 56.47 0 top
L7  4.7uH  [IND-SMD_L4.4-W4.2]  36.4 48.32 180 top
L8  4.7uH  [L0805]  34.57 18.87 0 top
L9  4.7uH  [L0805]  34.64 15.93 0 top
L10  15nH  [L0805]  50.22 29.45 180 top
L11  15nH  [L0805]  50.29 33.8 180 top
LED1  NCD0603R1  [LED0603-RD_RED]  7.53 5 0 top
LED2  NCD0603R1  [LED0603-RD_RED]  7.53 3.22 0 top
LED3  NCD0603R1  [LED0603-RD_RED]  7.53 1.44 0 top
LED4  NCD0603R1  [LED0603-RD_RED]  7.53 11.35 0 top
LED5  NCD0603R1  [LED0603-RD_RED]  7.53 9.57 0 top
LED6  NCD0603R1  [LED0603-RD_RED]  7.53 7.79 0 top
MIC1  GMI6027P-34DB  [MIC-TH_BD6.0-P1.90-D0.4-L]  55.12 28.42 270 top
MIC2  GMI6027P-34DB  [MIC-TH_BD6.0-P1.90-D0.4-L]  56.77 35.1 90 top
NC1  10nF  [C0603]  22.41 42.63 270 top
Q1  BCX51  [SOT-89-3_L4.5-W2.5-P1.50-LS4.2-BR]  58.66 46.05 0 top
R1  5.1kΩ  [R0603]  63.32 48.86 180 top
R2  5.1kΩ  [R0603]  63.32 47.13 180 top
R3  400mΩ  [R0805]  54.52 48.72 0 top
R4  12kΩ  [R0603]  33.37 44.34 180 top
R7  0Ω  [R0603]  20.83 22.14 180 top
R8  2.2kΩ  [R0603]  24.59 30.85 90 top
R9  2.2kΩ  [R0603]  44.63 30.21 270 top
R10  2.2kΩ  [R0603]  44.7 34.56 270 top
R11  0Ω  [R0805]  36 37.06 180 top
R13  220Ω  [R0603]  4.1 5 0 top
R14  220Ω  [R0603]  4.1 3.22 0 top
R15  220Ω  [R0603]  4.1 1.44 0 top
R16  220Ω  [R0805]  54.47 42.92 270 top
R17  10kΩ  [C0805]  35.2 56.86 180 top
R18  1kΩ  [C0805]  39.52 56.86 180 top
R19  12kΩ  [R0603]  33.37 42.56 180 top
R22  0Ω  [R0805]  43.63 56.87 180 top
R23  220Ω  [R0603]  4.1 11.35 0 top
R24  220Ω  [R0603]  4.1 9.57 0 top
R25  1kΩ  [R0603]  4.1 7.79 0 top
R26  10kΩ  [R0603]  49.23 38.28 0 top
SW1  TS-1101-C-W  [SW-SMD_L6.0-W3.3-LS8.0]  68.82 40.29 0 top
SW2  TS-1101-C-W  [SW-SMD_L6.0-W3.3-LS8.0]  6.54 44.06 180 top
SW3  TS-1101-C-W  [SW-SMD_L6.0-W3.3-LS8.0]  6.54 39.39 180 top
SW4  TS-1101-C-W  [SW-SMD_L6.0-W3.3-LS8.0]  6.54 34.72 180 top
SW5  TS-1101-C-W  [SW-SMD_L6.0-W3.3-LS8.0]  6.54 30.06 180 top
SW6  TS-1101-C-W  [SW-SMD_L6.0-W3.3-LS8.0]  6.54 25.39 180 top
SW7  TS-1101-C-W  [SW-SMD_L6.0-W3.3-LS8.0]  6.54 20.72 180 top
SW12  SMXS-04K-TP  [SW-SMD_SMXS-04K-TP]  45.61 44.5 270 top
U1  CSR8675C-IBBH-R  [BGA-112_L6.5-W6.5-P0.50-TL]  27.53 24.29 0 top
U2  SDB628  [SOT-23-6_L2.9-W1.6-P0.95-LS2.8-BR]  40.87 52.55 180 top
U4  HT6872  [SOP-8_L4.9-W3.9-P1.27-LS6.0-BL]  27.45 42.66 90 top
USB1  TYPE-C 16PIN 2MD(073)  [USB-C-SMD_TYPE-C-6PIN-2MD-073]  70.06 48.12 90 top
X1  26MHz  [OSC-SMD_4P-L2.0-W1.6-BL_X201624MKB4SI]  20.02 25.99 90 top

## Footprints (pads in the part's own frame, mm; a bottom-side part is the same pattern mirrored in y, then rotated)
ANT-SMD_L3.2-W1.6
  rect 1x1.75 smd: 1(-1.578,0) 2(1.578,0)
BGA-112_L6.5-W6.5-P0.50-TL
  round 0.256 smd: A1(-2.75,2.75) A2(-2.25,2.75) A3(-1.75,2.75) A4(-1.25,2.75) A5(-0.75,2.75) A6(-0.25,2.75) A7(0.25,2.75) A8(0.75,2.75) A9(1.25,2.75) A10(1.75,2.75) A11(2.25,2.75) A12(2.75,2.75) B1(-2.75,2.25) B2(-2.25,2.25) B3(-1.75,2.25) B4(-1.25,2.25) B5(-0.75,2.25) B6(-0.25,2.25) B7(0.25,2.25) B8(0.75,2.25) B9(1.25,2.25) B10(1.75,2.25) B11(2.25,2.25) B12(2.75,2.25) C1(-2.75,1.75) C2(-2.25,1.75) C3(-1.75,1.75) C4(-1.25,1.75) C5(-0.75,1.75) C6(-0.25,1.75) C7(0.25,1.75) C8(0.75,1.75) C9(1.25,1.75) C10(1.75,1.75) C11(2.25,1.75) C12(2.75,1.75) D1(-2.75,1.25) D2(-2.25,1.25) D3(-1.75,1.25) D10(1.75,1.25) D11(2.25,1.25) D12(2.75,1.25) E1(-2.75,0.75) E2(-2.25,0.75) E3(-1.75,0.75) E10(1.75,0.75) E11(2.25,0.75) E12(2.75,0.75) F1(-2.75,0.25) F2(-2.25,0.25) F3(-1.75,0.25) F6(-0.25,0.25) F7(0.25,0.25) F10(1.75,0.25) F11(2.25,0.25) F12(2.75,0.25) G1(-2.75,-0.25) G2(-2.25,-0.25) G3(-1.75,-0.25) G6(-0.25,-0.25) G7(0.25,-0.25) G10(1.75,-0.25) G11(2.25,-0.25) G12(2.75,-0.25) H1(-2.75,-0.75) H2(-2.25,-0.75) H3(-1.75,-0.75) H10(1.75,-0.75) H11(2.25,-0.75) H12(2.75,-0.75) J1(-2.75,-1.25) J2(-2.25,-1.25) J3(-1.75,-1.25) J10(1.75,-1.25) J11(2.25,-1.25) J12(2.75,-1.25) K1(-2.75,-1.75) K2(-2.25,-1.75) K3(-1.75,-1.75) K4(-1.25,-1.75) K5(-0.75,-1.75) K6(-0.25,-1.75) K7(0.25,-1.75) K8(0.75,-1.75) K9(1.25,-1.75) K10(1.75,-1.75) K11(2.25,-1.75) K12(2.75,-1.75) L1(-2.75,-2.25) L2(-2.25,-2.25) L3(-1.75,-2.25) L4(-1.25,-2.25) L5(-0.75,-2.25) L6(-0.25,-2.25) L7(0.25,-2.25) L8(0.75,-2.25) L9(1.25,-2.25) L10(1.75,-2.25) L11(2.25,-2.25) L12(2.75,-2.25) M1(-2.75,-2.75) M2(-2.25,-2.75) M3(-1.75,-2.75) M4(-1.25,-2.75) M5(-0.75,-2.75) M6(-0.25,-2.75) M7(0.25,-2.75) M8(0.75,-2.75) M9(1.25,-2.75) M10(1.75,-2.75) M11(2.25,-2.75) M12(2.75,-2.75)
C0603
  rect 0.8x0.9 smd: 1(-0.7,0) 2(0.7,0)
C0805
  rect 1.41x1.35 smd: 1(-1,0) 2(1,0)
CAP-TH_BD5.0-P2.00-D0.5-FD
  round 1.1 hole 0.7: 1(-1,0) 2(1,0)
CAP-TH_BD5.0-P2.00-D0.8-FD
  round 1.3 hole 0.8: 1(-1,0) 2(1,0)
D0603-BI
  rect 0.873x0.907 smd: 1(-0.622,0) 2(0.622,0)
F1210
  rect 1.485x2.781 smd: 1(-1.6,0) 2(1.6,0)
HDR-TH_2P-P2.54-V-M-1
  rect 1.8x1.8 hole 1: 1(-1.27,0)
  round 1.8 hole 1: 2(1.27,0)
HDR-TH_4P-P2.54-V-M
  rect 1.7x1.7 hole 1.1: 1(-3.81,0)
  round 1.7 hole 1.1: 2(-1.27,0) 3(1.27,0) 4(3.81,0)
HDR-TH_5P-P2.54-V-M
  rect 1.7x1.7 hole 1.1: 1(-5.08,0)
  round 1.7 hole 1.1: 2(-2.54,0) 3(0,0) 4(2.54,0) 5(5.08,0)
HDR-TH_20P-P2.54-V-M-1
  rect 1.8x1.8 hole 1.2: 1(-24.13,0)
  round 1.8 hole 1.2: 2(-21.59,0) 3(-19.05,0) 4(-16.51,0) 5(-13.97,0) 6(-11.43,0) 7(-8.89,0) 8(-6.35,0) 9(-3.81,0) 10(-1.27,0) 11(1.27,0) 12(3.81,0) 13(6.35,0) 14(8.89,0) 15(11.43,0) 16(13.97,0) 17(16.51,0) 18(19.05,0) 19(21.59,0) 20(24.13,0)
IND-SMD_L4.4-W4.2
  rect 1.4x2.12 smd: 1(2.028,0) 2(-2.028,0)
L0805
  rect 1.133x1.377 smd: 1(-0.966,0) 2(0.966,0)
LED0603-RD_RED
  rect 0.8x0.8 smd: 1(-0.799,-0.004) 2(0.799,0.004)
MIC-TH_BD6.0-P1.90-D0.4-L
  rect 1.3x1.3 hole 0.7: 1(-0.95,0)
  round 1.3 hole 0.7: 2(0.95,0)
OSC-SMD_4P-L2.0-W1.6-BL_X201624MKB4SI
  rect 1.1x0.8 smd: 1(-0.8,-0.575) 2(0.8,-0.575) 3(0.8,0.575) 4(-0.8,0.575)
R0603
  rect 0.806x0.864 smd: 1(-0.753,0) 2(0.753,0)
R0805
  rect 1.133x1.377 smd: 1(-1,0) 2(1,0)
SMA_L4.3-W2.5-LS5.0-RD
  rect 2x1.593 smd: 1(-2.1,0) 2(2.1,0)
SOD-123FL_L2.8-W1.8-LS3.7-RD
  rect 1.2x1.2 smd: 1(-1.6,0) 2(1.6,0)
SOP-8_L4.9-W3.9-P1.27-LS6.0-BL
  oval 0.63x1.865 smd: 1(-1.905,-2.683) 2(-0.635,-2.683) 3(0.635,-2.683) 4(1.905,-2.683) 5(1.905,2.683) 6(0.635,2.683) 7(-0.635,2.683) 8(-1.905,2.683)
SOT-23-6_L2.9-W1.6-P0.95-LS2.8-BR
  rect 1.1x0.6 smd: 1(1.35,-0.95) 2(1.35,0) 3(1.35,0.95) 4(-1.35,0.95) 5(-1.35,0) 6(-1.35,-0.95)
SOT-89-3_L4.5-W2.5-P1.50-LS4.2-BR
  rect 1.575x0.672 smd: 1(1.356,-1.5) 3(1.356,1.5)
  custom 5.377x1.9 smd: 2(-1.356,0)
SW-SMD_L6.0-W3.3-LS8.0
  rect 1.9x1.5 smd: 1(-4,0) 2(4,0)
SW-SMD_SMXS-04K-TP
  rect 1.1x2.2 smd: 1(-3.81,-4.4) 2(-1.27,-4.4) 3(1.27,-4.4) 4(3.81,-4.4) 5(3.81,4.4) 6(1.27,4.4) 7(-1.27,4.4) 8(-3.81,4.4)
USB-C-SMD_TYPE-C-6PIN-2MD-073
  rect 0.55x1.1 smd: 1(-3.2,2.375) 2(-2.4,2.375) 11(2.4,2.375) 12(3.2,2.375)
  rect 0.3x1.1 smd: 3(-1.75,2.375) 4(-1.25,2.375) 5(-0.75,2.375) 6(-0.25,2.375) 7(0.25,2.375) 8(0.75,2.375) 9(1.25,2.375) 10(1.75,2.375)
  oval 1.1x2 hole 0.6x1.5: 13(-4.325,1.825) 14(4.325,1.825)
  oval 1.2x1.8 hole 0.6x1.2: 13(-4.325,-2.375) 14(4.325,-2.375)

## Nets
As in the schematic.

Pads without a net: AE1 2; U1 B10 B11 B12 C2 C10 C11 C12 D11 D12 F6 G1 G2 G6 H1 H2 J2 J3; U2 6; USB1 3 9

## Via types
v1: diameter 0.25, hole 0.15, Top Layer to Bottom Layer, 46 vias
v2: diameter 0.61, hole 0.305, Top Layer to Bottom Layer, 4 vias

## Routing (per net, layer and track width the routed paths; a pad name or vN(x,y) marks a point on that pad's centre or on a via; arc(x,y) is an arc through that point)
1V8_SMPS: length 11.6
  Top Layer w0.076: C6.2 23.76,22.13 24.16,22.54 24.78,22.54 U1.K1 U1.J1
  Top Layer w0.152: U1.A1 23.33,27.04 20.92,29.46 C7.2
1V35_SMPS: length 3.1
  Top Layer w0.076: U1.M11 C26.1
3V3_USB: length 3.2
  Top Layer w0.076: C25.1 33.28,25.01 31.58,25.01 31.11,24.54 U1.F12
6V5: length 34.1
  Top Layer w0.254: 31.3,49.77 C30.2 ; 31.3,49.77 32.71,51.18 D4.1 34.2,54.62 R17.2 ; 31.3,49.77 C29.1 ; U4.6 22.44,43.3 NC1.1 C32.1 16.78,43.33 C35.1
  Bottom Layer w0.254: C35.1 22.61,49.77 C29.1
AGND: length 30.8
  Top Layer w0.254: C35.2 20.08,41.63 C32.2 NC1.2 ; C13.2 32.31,31.47 C21.2 ; NC1.2 24.68,41.93 U4.7 ; NC1.2 22.41,39.11 24.45,37.06 R11.2 35,39.85 C33.2
PGND: length 22.2
  Top Layer w0.254: C29.2 31.3,47.77 C30.1 31.87,47.74 33.5,46.11 35.84,46.11 36.19,46.46 36.19,49.58 39.16,52.55 U2.2 40.03,52.55 40.57,53.09 40.57,56.81 R18.1
VBAT+: length 26.4
  Top Layer w0.076: C4.2 33.11,21.27 30.84,23.54 U1.H12 30.03,23.29 30.03,22.8 30.28,22.55 U1.K12
  Top Layer w0.254: R16.1 52.62,45.77 50.57,45.77 ; 50.57,45.77 50.01,45.77 ; 50.57,45.77 R3.1 v2(53.52,50.18) ; F1.1 55.63,56.43 v2(53.58,56.43) 51.64,56.43 D5.2
  Bottom Layer w0.254: v2(53.52,50.18) 53.58,50.23 v2(53.58,56.43)
VBAT_SENSE: length 62
  Top Layer w0.076: Q1.2 57.31,46.06 61.48,46.06 62.31,45.23 62.31,27.25 57.37,22.31 32.44,22.31 30.96,23.8 30.04,23.8 U1.H11
  Top Layer w0.254: R3.2 57.31,46.94 Q1.2
VBUS: length 10.6
  Top Layer w0.254: Q1.3 55.66,51.91 F2.1 55.61,52.16 D6.2
VIN: length 11
  Top Layer w0.254: USB1.11 67.69,50.51 68.16,50.51 69.82,48.86 69.82,47.41 68.13,45.73 USB1.2
  Top Layer w0.55: 63.83,50.54 63.84,50.53 USB1.11
AIO1: length 26.9
  Top Layer w0.127: 16.15,2.17 17.35,3.37 17.35,14.08 22.74,19.47 22.74,23.5 U1.D1
BT_RF: length 32.9
  Top Layer w0.152: AE1.1 10.83,48.89 10.88,48.89 13.04,46.73 13.04,38.47 23.33,28.19 25.23,28.19 25.78,27.64 U1.A3
CHG_EXT: length 50.8
  Top Layer w0.076: U1.F11 30.02,24.78 31.03,24.78 32.15,25.9 59.14,25.9 61.47,28.23 61.47,44.27 61.19,44.55 60.02,44.55 Q1.1
CLK: length 15.8
  Top Layer w0.127: H4.4 21.14,10.84 21.14,17.06 23.11,19.03 23.11,23.37 U1.E1
CS: length 18.1
  Top Layer w0.076: H4.3 18.57,10.51 19.63,9.45 22.84,9.45 25.03,11.65 25.03,21.29 U1.M1
CTRL: length 15.7
  Top Layer w0.254: v2(31.45,38.89) 30.14,40.21 U4.1 ; SW12.3 41.21,40.31 v2(39.8,38.9)
  Bottom Layer w0.254: v2(31.45,38.89) 39.79,38.89 v2(39.8,38.9)
LDO_SW1: length 4.2
  Top Layer w0.254: D6.1 47.4,52.17 D5.1
LDO_SW2: length 9.7
  Top Layer w0.254: U2.4 42.22,49.32 SW12.1 41.19,48.32 38.43,48.32 ; U2.4 U2.5 ; U2.4 44.4,51.6 C27.2
LED0: length 30.9
  Top Layer w0.076: R13.1 3.35,5.75 v1(3.68,6.08)
  Bottom Layer w0.076: v1(3.68,6.08) 20.38,22.79 26.07,22.79 v1(26.28,22.54)
LED1: length 31.5
  Top Layer w0.076: v1(4.1,4.05) 4.1,3.97 R14.1
  Bottom Layer w0.076: v1(4.1,4.05) 22.35,22.3 26.53,22.3 v1(26.78,22.54)
LED2: length 39.2
  Top Layer w0.076: R15.1 v1(4.1,2.19)
  Inner2 w0.076: v1(4.1,2.19) 6.16,4.25 22.59,4.25 26.28,7.94 26.28,21.54 v1(26.28,21.54)
MIC_BIAS_A: length 22.5
  Top Layer w0.076: C18.1 42.76,36.36 42.39,36.72 39.69,36.72 39.17,36.21 39.17,34.71 33.22,28.76 29.58,28.76 28.78,27.96 U1.A9
  Top Layer w0.254: C18.1 42.9,35.32 44.7,35.32
MIC_BIAS_B: length 19.5
  Top Layer w0.076: U1.B8 28.53,26.78 30.46,26.78 31.89,28.21 33.58,28.21 37.47,32.11 42.31,32.11 42.68,31.74 42.68,31.11 C15.1
  Top Layer w0.254: C15.1 42.8,30.97 R9.1
MIC_LN: length 17.9
  Top Layer w0.076: C18.2 42.03,34.79 42.03,32.76 41.63,32.36 37.41,32.36 33.44,28.39 30.66,28.39 29.78,27.51 U1.A11
MIC_LP: length 15.4
  Top Layer w0.076: 41.33,33.68 41.32,33.69 38.45,33.69 33.33,28.57 29.84,28.57 29.28,28.01 U1.A10
MIC_RN: length 15.1
  Top Layer w0.076: U1.C8 28.53,26.29 30.43,26.29 32.17,28.03 33.73,28.03 36.81,31.1 C15.2
MIC_RP: length 15.1
  Top Layer w0.076: C16.2 35.38,29.32 33.89,27.83 32.53,27.83 30.49,25.79 28.03,25.79 U1.C7
MISO: length 17.4
  Bottom Layer w0.076: v1(25.28,22.04) 25.03,21.79 22.93,21.79 13.47,12.33 13.47,10.82 H4.1
MOSI: length 22
  Inner2 w0.076: v1(25.78,24.04) 25.54,23.8 17.53,23.8 16.03,22.3 H4.2
PIO0: length 23
  Top Layer w0.076: H2.18 18.69,2.23 26.03,9.57 26.03,21.79 U1.L4
PIO1: length 22.2
  Top Layer w0.076: H2.17 21.23,3.84 26.53,9.13 26.53,21.79 U1.L5
PIO2: length 20.6
  Top Layer w0.076: U1.M5 26.78,7.13 23.77,4.12 23.77,2.18 H2.16
PIO3: length 20.8
  Inner2 w0.076: H2.15 27.04,2.9 27.04,22.3 v1(27.28,22.54)
PIO4: length 20.8
  Inner2 w0.076: H2.14 28.03,2.99 28.03,22.29 v1(28.28,22.54)
PIO5: length 22.2
  Top Layer w0.076: U1.L7 27.64,22.04 27.4,21.79 27.16,21.79 27.04,21.67 27.04,10 31.41,5.64 31.41,2.18 H2.13
PIO6: length 22.1
  Top Layer w0.076: H2.12 33.93,4.23 27.28,10.88 U1.M6
PIO7: length 23.8
  Inner4 w0.076: H2.11 36.47,2.41 28.53,10.35 28.53,22.29 v1(28.78,22.54)
PIO8: length 27.1
  Top Layer w0.076: H2.10 39.01,3.29 37.87,4.43 34.49,4.43 27.54,11.38 27.54,21.66 27.66,21.79 28.03,21.79 U1.L8
PIO9: length 28.4
  Inner2 w0.076: v1(29.28,22.04) 29.04,21.79 28.64,21.79 28.53,21.69 28.53,12.7 36.09,5.15 40.6,5.15 41.53,4.22 41.53,2.19 H2.9
PIO10: length 30.5
  Bottom Layer w0.076: H2.8 44.15,2.22 44.15,4.39 42,6.53 34.24,6.53 28.28,12.49 v1(28.28,21.54)
PIO11: length 32.9
  Bottom Layer w0.076: H2.7 46.62,2.18 46.62,3.93 43.74,6.81 34.43,6.81 28.53,12.71 28.53,21.79 v1(28.78,22.04)
PIO12: length 35.4
  Bottom Layer w0.076: 49.17,3.5 45.57,7.1 34.69,7.1 28.82,12.97 28.82,20.61 29.04,20.83 29.04,22.32 29.26,22.54 v1(29.28,22.54) ; 49.17,3.5 H2.6
PIO14: length 41.6
  Top Layer w0.076: H2.4 54.26,2.18 54.26,4.56 52.9,5.93 33.6,5.93 27.78,11.74 U1.M7
PIO15: length 50.9
  Inner2 w0.076: v1(27.28,22.04) 27.28,3.51 27.54,3.25 27.54,1.37 28.15,0.76 55.44,0.76 56.79,2.12 H2.3
ROUT+: length 18.8
  Top Layer w0.254: U4.5 22.37,44.57 20.99,45.95 20.99,46.01 arc(21.13,46.36) 21.49,46.51 21.68,46.51 arc(22.18,47.01) 21.68,47.51 21.49,47.51 arc(20.99,48.01) 21.49,48.51 21.77,48.51 arc(22.27,49.01) 21.77,49.51 21.49,49.51 arc(20.99,50.01) 21.49,50.51 21.77,50.51 arc(22.27,51.01) 21.77,51.51 21.49,51.51 arc(21.13,51.66) 20.99,52.01 20.99,52.92 H12.2 H12.1
ROUT-: length 18.8
  Top Layer w0.254: U4.8 24.78,40.75 26.11,40.75 27.12,41.76 27.12,45.03 26.15,46.01 24.73,46.01 23.52,47.22 H12.3 H12.4
SPKR_L+:
  vias: v1(26.78,26.04)
SPKR_L-:
  vias: v1(27.28,26.04)
SPKR_R+: length 25.1
  Top Layer w0.076: U1.B7 28.03,26.79 28.03,27.97 29.01,28.95 33.11,28.95 38.45,34.28 38.45,43.13 C31.1
SPKR_R-: length 22.7
  Top Layer w0.076: C3.1 38.2,41.6 38.2,34.33 33,29.13 28.85,29.13 27.78,28.06 U1.A7
UART_CTS: length 17.1
  Top Layer w0.076: U1.L3 25.53,21.79 25.53,11.28 H11.4
UART_RX: length 18.7
  Top Layer w0.076: H11.3 19.9,8.19 22.04,8.19 25.28,11.44 U1.M2
UART_TX: length 21.5
  Bottom Layer w0.076: H11.2 16.03,7.39 17.3,8.66 22.07,8.66 25.78,12.38 v1(25.78,21.54)
USB_DN: length 3.3
  Top Layer w0.254: 66.65,48.09 66.94,48.38 USB1.7 ; 66.65,48.09 66.65,47.68 66.96,47.38 USB1.5 ; 66.65,48.09 66.64,48.11 v1(66.12,48.11)
USB_DP: length 5.2
  Top Layer w0.076: U1.M9 29.03,21.79 29.03,22.79 28.61,23.22 v1(28.6,23.22)
  Top Layer w0.254: v1(69.16,48.1) 69.15,48.09 68.7,48.09 ; USB1.8 68.46,48.88 68.7,48.64 68.7,48.09 ; 68.7,48.09 68.48,47.88 USB1.6
VREGENABLE: length 29.8
  Top Layer w0.076: v1(36.36,45.77) 36.37,45.77 41.21,45.77
  Bottom Layer w0.076: 36.36,45.77 28.03,37.44 28.03,25.78 28.78,25.04 v1(29.28,25.04)
XTAL_IN: length 4.5
  Top Layer w0.076: X1.1 21.54,25.19 22.39,26.03 24.78,26.03 U1.C1
XTAL_OUT: length 6.3
  Top Layer w0.076: U1.B1 22.69,26.54 21.46,27.77 20.42,27.77 X1.3
$1N4263: length 3.7
  Top Layer w0.254: USB1.4 64.32,46.88 R2.1
$1N4265: length 4
  Top Layer w0.254: R1.1 64.96,48.86 65.97,49.88 USB1.10
$1N4429: length 3.8
  Top Layer w0.076: U1.G11 U1.G12 31.05,24.04 31.94,23.16 33.25,23.16 C23.1
$1N4631: length 6
  Top Layer w0.076: L8.1 33.16,18.87 32.12,19.9 32.12,21.54 30.62,23.04 U1.J12
$1N5186: length 8.2
  Top Layer w0.076: C8.2 21.58,20.37 R7.1 21.58,23.17 24.21,25.8 25.54,25.8 U1.C3
$1N5323: length 7.9
  Top Layer w0.076: U1.L12 31.63,20.69 31.63,17.37 33.07,15.93 33.67,15.93
$1N5614: length 6.2
  Top Layer w0.076: U1.A2 25.53,26.79 25.95,26.79 26.03,26.87 26.03,29.66 C10.1 R8.1
$1N6128: length 4.2
  Top Layer w0.076: C14.1 33.25,26.83 31.94,26.83 31.25,26.14 31.25,25.38 30.9,25.04 U1.E12
$1N7565: length 4.6
  Top Layer w0.254: 46.53,29.46 C17.2 ; 46.53,29.46 49.25,29.46 L10.2 ; 46.53,29.46 R9.2
$1N7575: length 4
  Top Layer w0.254: L10.1 55.04,29.45 MIC1.1
$1N7808: length 4.6
  Top Layer w0.254: L11.2 49.32,33.81 C20.2 44.71,33.81 R10.2
$1N7817: length 5.7
  Top Layer w0.254: MIC2.1 56.42,33.8 L11.1
$1N9013: length 5
  Top Layer w0.076: C21.1 31.76,29.51 v1(31.75,29.51)
  Bottom Layer w0.076: 31.75,29.51 v1(28.78,26.54)
$1N10961: length 4.4
  Top Layer w0.254: F2.2 59.66,52.21 61.32,50.55 62.58,50.55 D1.1
$1N11416: length 3.6
  Top Layer w0.254: R16.2 57.99,41.92 C24.1
$1N22358: length 8.6
  Top Layer w0.254: U2.1 39.16,53.14 D4.2 34.37,50.59 L7.1
$1N22359: length 2.3
  Top Layer w0.254: R17.1 R18.2
$1N22776: length 2.8
  Top Layer w0.254: U4.3 31.88,43.3 R19.2
$1N22777: length 2.6
  Top Layer w0.254: U4.4 32.38,44.57 R4.2
$1N22778: length 1.7
  Top Layer w0.254: R19.1 C3.2
$1N22779: length 1.7
  Top Layer w0.254: R4.1 C31.2
$1N22784: length 3
  Top Layer w0.254: C33.1 31.42,42.03 U4.2
$1N33999: length 5.2
  Top Layer w0.254: F1.2 63.95,56.4 H13.1
$1N43561: length 2.4
  Top Layer w0.254: R26.2 50.01,38.3 50.01,40.69

## Copper pours and planes (outline as drawn; the poured copper is in the pictures)
GND on Inner1: -24.29,59.3 75.19,59.3 75.19,-10.19 -24.29,-10.19
VBUS on Inner3: -24.29,59.3 75.19,59.3 75.19,-10.19 -24.29,-10.19

Small or netless copper shapes (teardrops, artwork), in the pictures only: 40 on Inner1, 12 on Inner3
